# EasyEDA Pro project ProPrj_MBC1  FRAM（AM29F016）(定稿)_2024-09-28.epro, board 1_1
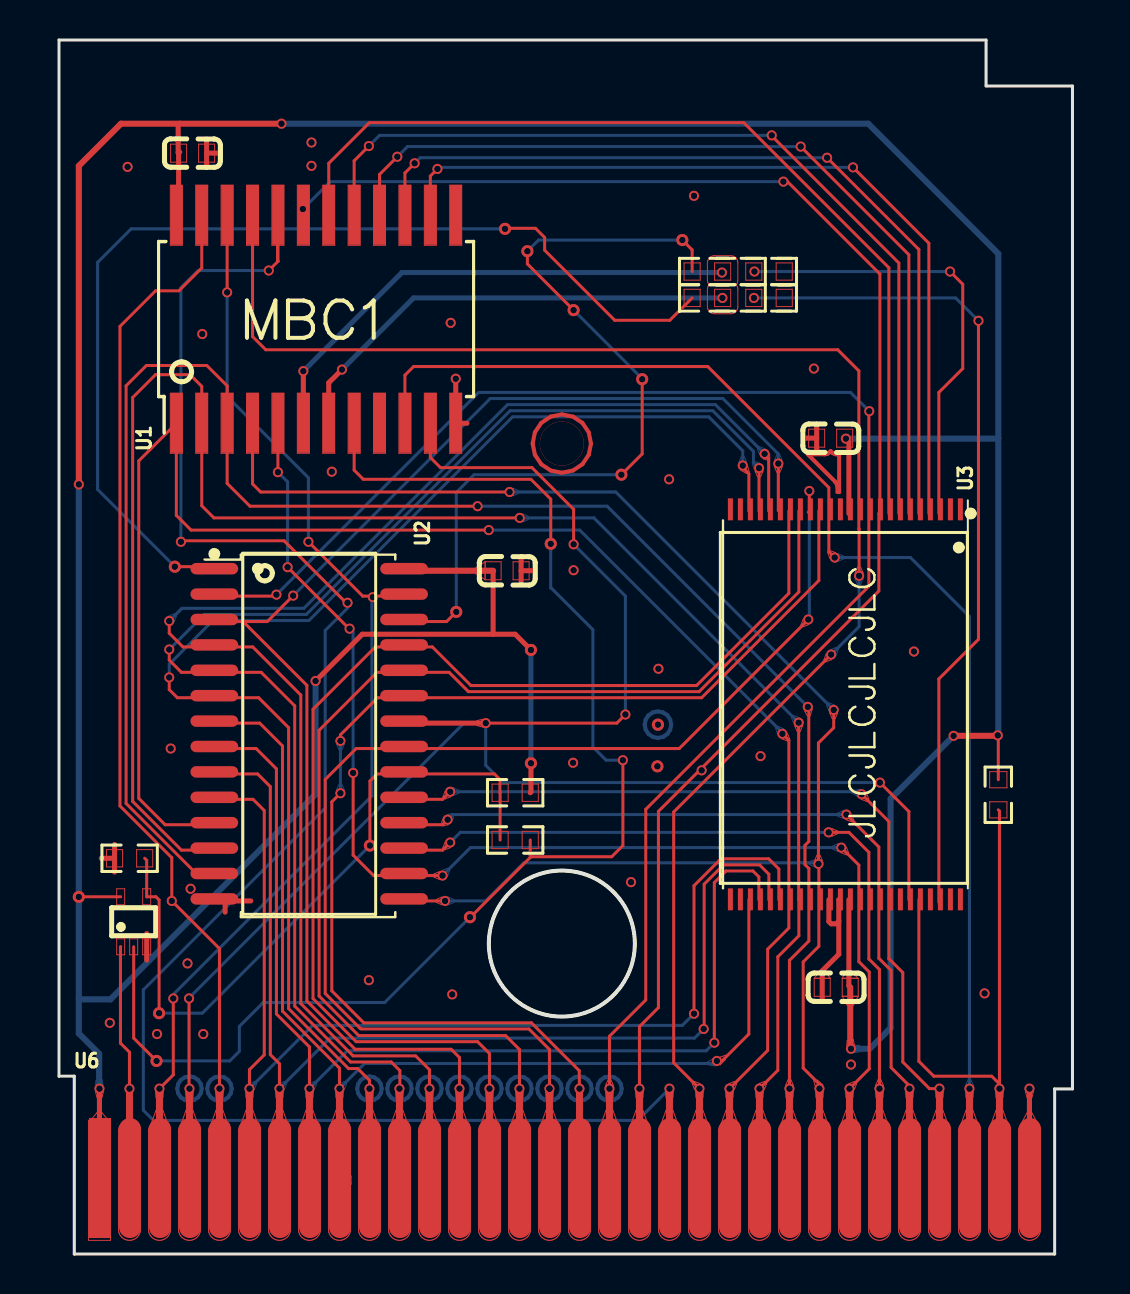
[diagram p5: board, top side]
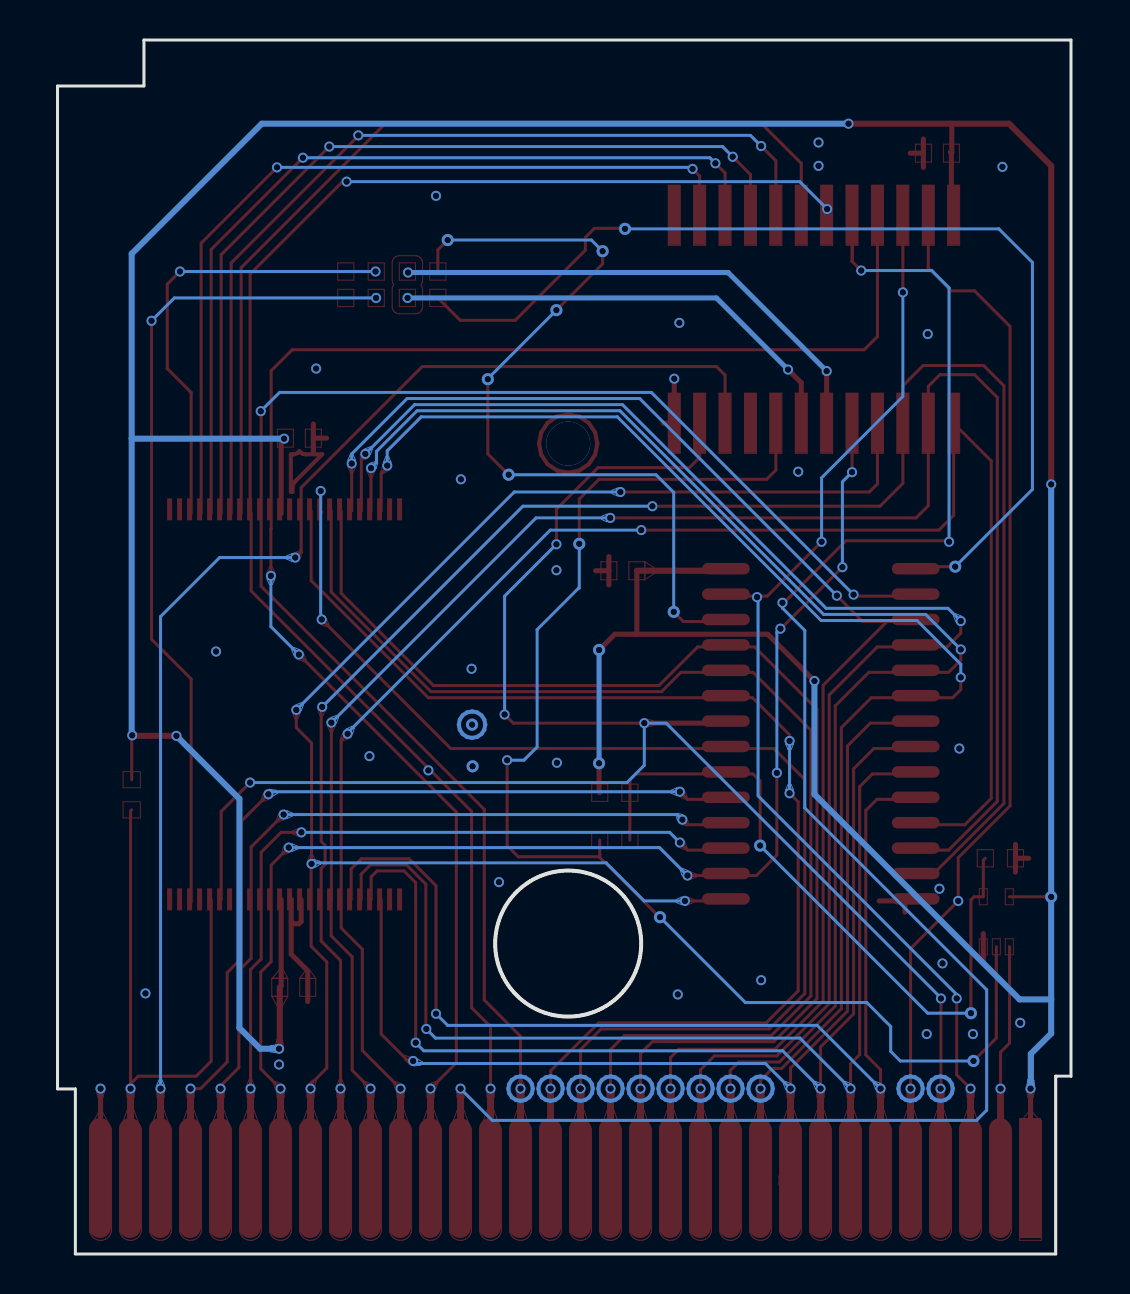
[diagram p6: board, bottom side, seen from below]

Outline 50.67 x 60.7 mm; copper layers: Top Layer, Bottom Layer. Coordinates in mm from the lower left corner of the outline.
Outline path: circle c25.14,15.52 r3.65 ; 0,60.7 46.35,60.7 46.35,58.4 50.67,58.4 50.67,8.25 49.78,8.25 49.78,0 0.76,0 0.76,8.89 0,8.89 0,60.7 ; 21.49,15.52 arc(25.14,19.17) 28.79,15.52 arc(25.14,11.87) 21.49,15.52
Stack: Top Layer 0.035mm / Dielectric1 1.51mm FR4 er 4.5 / Bottom Layer 0.035mm

## Design rules (mm)
spacing safeClearance (default): track to track 0.152, other pairs 0.152 to 0.3
track width trackWidth (default): min 0.127, default 0.254, max 2.54
differential pair differentialPair (default): width min 0.127, default 0.254, max 2.54; gap min 0.152, default 0.152
via viaSize (default): diameter min 0.5, default 0.61, max 10; hole min 0.3, default 0.305, max 6

## Placement (name value [footprint] x y rotation side)
U1  -  [MemoryBC1:SOIC-24 W_7.5x15.4mm_P1.27mm]  12.86 46.76 90 top
U2  FM1808B-SGTR  [SOIC-28_L17.9-W7.5-P1.27-LS10.3-BL]  12.51 26.01 270 top
U3  -  [Package_SO:TSOP-I-48_18.4x12mm_P0.5mm]  39.32 27.48 270 top
U6  -  [gbgba cartbus]  25.3 3.8 0 top

## Footprints (pads in the part's own frame, mm; a bottom-side part is the same pattern mirrored in y, then rotated)
gbgba cartbus
  rect 1.1x6 smd: 1(-23.25,0)
  oval 1.1x6 smd: 2(-21.75,0) 3(-20.25,0) 4(-18.75,0) 5(-17.25,0) 6(-15.75,0) 7(-14.25,0) 8(-12.75,0) 9(-11.25,0) 10(-9.75,0) 11(-8.25,0) 12(-6.75,0) 13(-5.25,0) 14(-3.75,0) 15(-2.25,0) 16(-0.75,0) 17(0.75,0) 18(2.25,0) 19(3.75,0) 20(5.25,0) 21(6.75,0) 22(8.25,0) 23(9.75,0) 24(11.25,0) 25(12.75,0) 26(14.25,0) 27(15.75,0) 28(17.25,0) 29(18.75,0) 30(20.25,0) 31(21.75,0) 32(23.25,0)
MemoryBC1:SOIC-24 W_7.5x15.4mm_P1.27mm
  rect 3x0.6 smd: 1(-5.2,6.985) 2(-5.2,5.715) 3(-5.2,4.445) 4(-5.2,3.175) 5(-5.2,1.905) 6(-5.2,0.635) 7(-5.2,-0.635) 8(-5.2,-1.905) 9(-5.2,-3.175) 10(-5.2,-4.445) 11(-5.2,-5.715) 12(-5.2,-6.985) 13(5.2,-6.985) 14(5.2,-5.715) 15(5.2,-4.445) 16(5.2,-3.175) 17(5.2,-1.905) 18(5.2,-0.635) 19(5.2,0.635) 20(5.2,1.905) 21(5.2,3.175) 22(5.2,4.445) 23(5.2,5.715) 24(5.2,6.985)
Package_SO:TSOP-I-48_18.4x12mm_P0.5mm
  rect 1.1x0.25 smd: 1(-9.75,5.75) 2(-9.75,5.25) 3(-9.75,4.75) 4(-9.75,4.25) 5(-9.75,3.75) 6(-9.75,3.25) 7(-9.75,2.75) 8(-9.75,2.25) 9(-9.75,1.75) 10(-9.75,1.25) 11(-9.75,0.75) 12(-9.75,0.25) 13(-9.75,-0.25) 14(-9.75,-0.75) 15(-9.75,-1.25) 16(-9.75,-1.75) 17(-9.75,-2.25) 18(-9.75,-2.75) 19(-9.75,-3.25) 20(-9.75,-3.75) 21(-9.75,-4.25) 22(-9.75,-4.75) 23(-9.75,-5.25) 24(-9.75,-5.75) 25(9.75,-5.75) 26(9.75,-5.25) 27(9.75,-4.75) 28(9.75,-4.25) 29(9.75,-3.75) 30(9.75,-3.25) 31(9.75,-2.75) 32(9.75,-2.25) 33(9.75,-1.75) 34(9.75,-1.25) 35(9.75,-0.75) 36(9.75,-0.25) 37(9.75,0.25) 38(9.75,0.75) 39(9.75,1.25) 40(9.75,1.75) 41(9.75,2.25) 42(9.75,2.75) 43(9.75,3.25) 44(9.75,3.75) 45(9.75,4.25) 46(9.75,4.75) 47(9.75,5.25) 48(9.75,5.75)
SOIC-28_L17.9-W7.5-P1.27-LS10.3-BL
  oval 0.574x2.388 smd: 1(-8.255,-4.744) 2(-6.985,-4.744) 3(-5.715,-4.744) 4(-4.445,-4.744) 5(-3.175,-4.744) 6(-1.905,-4.744) 7(-0.635,-4.744) 8(0.635,-4.744) 9(1.905,-4.744) 10(3.175,-4.744) 11(4.445,-4.744) 12(5.715,-4.744) 13(6.985,-4.744) 14(8.255,-4.744) 15(8.255,4.744) 16(6.985,4.744) 17(5.715,4.744) 18(4.445,4.744) 19(3.175,4.744) 20(1.905,4.744) 21(0.635,4.744) 22(-0.635,4.744) 23(-1.905,4.744) 24(-3.175,4.744) 25(-4.445,4.744) 26(-5.715,4.744) 27(-6.985,4.744) 28(-8.255,4.744)

## Nets
5V: U1.24 U2.28 U3.12 U3.37 U6.1
GND: U1.12 U2.14 U3.35 U3.36 U6.32
A0: U2.10 U3.30 U6.6
A1: U2.9 U3.29 U6.7
A2: U2.8 U3.28 U6.8
A3: U2.7 U3.27 U6.9
A4: U2.6 U3.22 U6.10
A5: U2.5 U3.21 U6.11
A6: U2.4 U3.20 U6.12
A7: U2.3 U3.19 U6.13
A8: U2.25 U3.18 U6.14
A9: U2.24 U3.17 U6.15
A10: U2.21 U3.16 U6.16
A11: U2.23 U3.15 U6.17
A12: U2.2 U3.10 U6.18
A13: U1.19 U3.9 U6.19
A14: U1.20 U6.20
A15: U6.21
A16: U1.16 U3.6
A17: U1.15 U1.21 U3.5
A18: U1.14 U3.4
AU: U3.44 U6.31
CE: U2.20 U3.11
CLK: U6.2
CS: U1.23 U6.5
D0: U2.11 U3.31 U6.22
D1: U1.2 U2.12 U3.32 U6.23
D2: U1.3 U2.13 U3.33 U6.24
D3: U1.4 U2.15 U3.34 U6.25
D4: U1.5 U2.16 U3.38 U6.26
D5: U2.17 U3.39 U6.27
D6: U2.18 U3.40 U6.28
D7: U2.19 U3.41 U6.29
DO: U1.1
EA0: U1.6 U1.7
O1: U2.1
O2: U2.26
O3: U3.3
O4: U3.46
RA14: U1.18 U3.8
RA15: U1.17 U3.7
RAMCS: U1.8
RD: U1.11 U2.22 U3.43 U6.4
RST: U1.10 U3.14 U6.30
WR: U1.22 U2.27 U6.3

Pads without a net: U1 9 13; U3 1 2 13 23 24 25 26 42 45 47 48

## Via types
v1: diameter 0.305, hole 0.305, Top Layer to Bottom Layer, 161 vias
v2: diameter 0.508, hole 0.305, Top Layer to Bottom Layer, 141 vias
v3: diameter 0.61, hole 0.305, Top Layer to Bottom Layer, 18 vias
v4: diameter 2.2, hole 2.2, Top Layer to Bottom Layer, 1 via

## Routing (per net, layer and track width the routed paths; a pad name or vN(x,y) marks a point on that pad's centre or on a via; arc(x,y) is an arc through that point)
(no net): length 2813.1
  Top Layer w0.152: 31.66,47.8 30.54,46.69 27.79,46.69 24.28,50.19 24.28,50.83 23.82,51.28 22.33,51.28 v3(22.3,51.26) ; v1(5.51,28.83) 5.51,28.22 5.92,27.81 9.98,27.81 11.48,26.32 11.48,12.27 14.48,9.27 14.94,9.27 15.52,8.68 v2(15.52,8.27) ; v1(29.16,43.74) 29.16,40 v3(28.12,38.96) ; 9.68,41.54 9.68,38.51 10.08,38.1 v2(22.53,38.1) ; v1(19.86,32.11) 19.38,31.62 17.6,31.62 ; v1(36.17,26.01) 36.49,25.69 36.49,16.3 35.43,15.24 35.43,10.18 v1(33.52,8.27) ; v2(39.12,20.32) 39.99,19.44 39.99,14.62 40.51,14.1 40.51,9.26 v1(39.52,8.27) ; 37.47,37.08 37.52,37.14 v1(37.52,38.15) ; 34.49,37.15 34.49,39.01 34.19,39.32 v2(34.19,39.42) ; v2(10.87,32.97) 10.79,32.89 8.3,32.89 ; v1(20.93,37.39) 9.55,37.39 8.41,38.53 8.41,43.41 7.39,44.42 4.37,44.42 3.35,43.41 3.35,22.53 6.96,18.92 8.3,18.92 ; v2(38.41,54.81) 42.99,50.22 42.99,37.03 ; v1(5.51,31.65) 5.51,31.04 6.2,30.35 9.69,30.35 12.09,27.95 12.09,12.52 14.71,9.91 17.83,9.91 18.52,9.21 v2(18.52,8.27) ; v1(8.02,8.27) 8.02,15.27 v2(5.64,17.65) 5.64,19.81 3.05,22.4 3.05,46.38 4.83,48.16 5.99,48.16 7.14,49.3 7.14,51.94 ; 22.06,20.7 22.06,23.06 22.05,23.07 22.05,23.72 21.77,24 15.9,24 15.54,23.65 v1(15.54,20.42) ; v1(6.52,8.27) 6.5,8.29 v1(6.5,12.78) ; v1(17.78,54.53) 17.3,54.05 17.3,51.94 ; v1(35.28,40) 35.28,39.95 35.48,39.75 35.48,37.15 ; v2(36.52,8.27) 36.52,14.68 37.49,15.65 37.49,19.28 37.3,19.47 37.3,20.43 37.49,20.62 37.49,27.31 v1(37.44,27.36) ; 8.3,22.73 9.7,22.73 10.26,22.17 10.26,9.96 9.52,9.22 v1(9.52,8.27) ; v1(25.73,47.19) 23.42,49.5 v3(23.42,50.14) ; 41.49,37.03 41.49,49.31 34.24,56.57 15.52,56.57 13.49,54.53 13.49,51.94 ; v2(40.13,22.99) 41.49,21.63 41.49,14.77 42.19,14.07 42.19,9.6 43.52,8.27 v1(44.02,8.27) ; v3(20.55,16.84) 20.57,16.84 23.56,19.83 23.56,19.94 ; v2(20.02,8.27) 20.02,9.82 19.61,10.24 14.81,10.24 12.4,12.65 12.4,28.43 9.2,31.62 ; 18.57,41.54 18.57,39.83 19.07,39.32 23.65,39.32 25.73,37.24 v1(25.73,35.48) ; 43.49,37.03 43.49,50.54 v1(39.7,54.33) ; 31.66,49.12 31.66,50.21 v3(31.17,50.7) ; 43.99,17.58 43.99,28.75 45.97,30.73 v2(45.97,46.66) ; 41.99,37.03 41.99,49.55 35.64,55.91 v2(35.64,55.93) ; 36.49,37.15 36.49,33.04 31.88,28.42 20.6,28.42 18.67,30.35 15.82,30.35 12.7,27.24 12.7,12.77 14.86,10.62 20.93,10.62 21.52,10.02 v1(21.52,8.27) ; v2(11.43,34.34) 14.5,31.27 v1(14.53,31.27) ; v1(19.56,20.57) 19.18,20.19 17.6,20.19 ; 9.2,31.62 10.41,31.62 v2(11.71,32.92) ; 9.2,31.62 8.9,31.62 ; 8.3,21.46 5.31,21.46 3.99,22.78 3.99,39.66 5.87,41.54 5.87,36.93 6.6,36.19 v2(21.49,36.19) ; v1(40.51,42.14) 40.49,42.12 40.49,33.39 29.34,22.23 29.34,12.7 27.52,10.89 v1(27.52,8.27) ; 32.08,24.24 32.13,24.18 v2(32.13,24.18) ; 32.08,24.24 40.99,33.15 41,37.03 ; 32.08,24.24 29.97,22.13 29.97,12.32 29.02,11.37 v1(29.02,8.27) ; 8.3,34.16 8.1,34.37 v3(5.79,34.37) ; v1(12.52,8.27) 12.52,10.35 10.87,12 10.87,24.26 9.85,25.27 8.3,25.27 ; 14.76,51.94 14.76,54.66 v2(15.49,55.4) ; 23.56,19.94 23.56,20.7 ; 23.56,19.94 23.64,19.86 27.63,19.86 28.19,20.42 v1(28.19,24.69) ; 42.49,17.71 42.49,22.12 v2(41.05,23.57) ; v1(28.32,26.97) 27.89,26.54 v2(21.34,26.54) ; 15.75,32.89 17.6,32.89 ; 15.75,32.89 v1(15.7,32.84) ; 15.75,32.89 15.19,32.89 v1(12.47,35.61) ; v1(40,33.91) 40,36.24 39.99,36.25 39.99,44.16 38.94,45.21 10.34,45.21 9.68,45.87 9.68,51.94 ; v2(37.47,31.72) 31.01,25.27 14.86,25.27 13.31,23.72 13.31,13.03 15.06,11.28 15.09,11.28 15.11,11.25 23.5,11.25 24.52,10.22 v1(24.52,8.27) ; v2(14.07,23.04) 13.64,22.61 13.64,13.16 15.24,11.56 23.62,11.56 26.01,9.17 v1(26.02,8.27) ; v1(5.72,12.78) 5.72,8.96 v1(5.02,8.27) ; v2(36.98,26.57) 36.98,17.72 36.99,17.71 36.99,15.91 35.94,14.86 35.94,9.19 v1(35.02,8.27) ; 8.89,31.63 8.9,31.62 ; 8.9,31.62 8.3,31.62 ; 8.3,26.54 10.04,26.54 11.18,25.4 11.18,12.14 14.02,9.29 v2(14.02,8.27) ; v1(38.48,21.08) 39.5,21.08 40.49,20.09 40.49,14.75 41.02,14.22 v1(41.02,8.27) ; v1(31.75,12.01) 31.75,18.42 33.1,19.76 35.48,19.76 35.99,19.25 35.99,17.71 ; v2(32.23,11.25) 32.26,11.28 32.26,18.49 33.22,19.46 35.03,19.46 35.49,18.99 35.49,17.71 ; v2(32.89,9.65) 33.15,9.65 34.49,11 34.49,17.71 ; v1(0.99,17.86) 1,17.86 3.08,17.86 ; v1(32.77,10.57) 32.77,18.57 33.35,19.15 34.7,19.15 34.99,18.86 34.99,17.71 ; v2(3.52,8.27) 3.52,10.09 3.07,10.54 3.07,15.35 3.08,15.36 ; 4.28,19.79 4.38,19.69 4.38,17.86 4.85,17.86 5,17.7 v3(5,12.04) ; 36.99,37.15 36.99,33.11 32,28.12 20.47,28.12 19.51,29.08 15.9,29.08 13,26.19 13,12.9 14.98,10.92 22.33,10.92 23.02,10.23 v1(23.02,8.27) ; v2(5.51,30.23) 5.51,29.69 6.12,29.08 10.11,29.08 11.79,27.41 11.79,12.39 14.58,9.6 16.61,9.6 17.04,9.17 17.04,8.29 v2(17.02,8.27) ; v2(14.43,32.56) 14.35,32.56 11.25,35.66 6.15,35.66 v2(6.1,35.61) ; v1(46.94,25.93) 46.97,25.91 46.97,23.72 ; v2(47.02,8.27) 47.02,8.5 ; 47.02,8.5 47.02,22.15 46.97,22.21 ; 47.02,8.5 46.63,8.89 43.74,8.89 42.99,9.64 42.99,17.71 ; v2(8.41,48.08) 8.41,51.94 ; v2(39.37,21.97) 40.99,20.35 40.99,14.78 41.6,14.17 41.6,9.32 42.52,8.4 v2(42.52,8.27) ; v2(19.56,23.11) 19.18,22.73 17.6,22.73 ; 12.22,51.94 12.22,52.22 v2(12.19,52.25) ; 16.03,51.94 16.03,53.97 v1(16.92,54.86) ; 3.73,15.36 3.73,10.79 v1(4.88,9.65) ; v2(11.02,8.27) 11.02,9.51 10.57,9.97 10.57,23.37 9.93,24 8.3,24 ; 35.99,37.15 35.97,37.18 v2(35.97,39.52) ; 40.99,37.03 41.04,37.08 41.04,49 36.42,53.62 v2(36.22,53.62) ; 17.6,17.65 v1(19.3,17.65) ; v1(35,39.29) 35,37.15 ; v2(18.92,54.25) 18.57,53.9 18.57,51.94 ; v1(38.74,27.2) 38.74,26.31 37.97,25.55 v2(37.97,19.51) 37.99,19.49 37.99,15.39 37.21,14.61 37.21,9.29 38.02,8.48 v2(38.02,8.27) ; 43.99,37.03 43.99,43.08 45.19,44.27 45.19,48.49 v2(44.55,49.12) ; v1(10.95,39.09) 10.95,41.54 ; 10.95,49.64 10.93,49.66 10.93,51.92 10.95,51.94 10.95,49.64 ; 10.95,49.64 10.95,49.63 v1(10.49,49.17) ; v1(32.02,8.27) 30.73,9.56 30.73,22.1 v1(38.61,29.97) ; v1(19.43,21.72) 19.18,21.46 17.6,21.46 ; v1(24.59,35.51) 24.59,37.74 23.6,38.73 15.22,38.73 14.76,39.19 14.76,41.54 ; 17.3,41.54 17.3,43.94 17.73,44.37 32.44,44.37 38.49,38.32 38.49,35.12 v2(38.79,34.82) ; v1(37.08,55.37) 42.49,49.96 42.49,37.03 ; 8.3,20.19 6.12,20.19 3.68,22.63 3.68,42.82 4.83,43.97 6.55,43.97 7.14,43.38 7.14,37.41 7.75,36.81 v1(23.04,36.81) ; 37.99,37.15 37.99,33.67 32.13,27.81 15.93,27.81 14.07,25.96 v1(14.07,25.65) ; v2(19.18,18.92) 15.73,18.92 14.71,19.94 v2(14.71,24.05) ; 26.01,7.98 26.02,7.97
  Top Layer w0.203: 23.68,40.52 23.79,39.96 24.11,39.49 24.58,39.17 25.14,39.06 25.7,39.17 26.17,39.49 26.49,39.96 26.6,40.52 26.49,41.08 26.17,41.55 25.7,41.87 25.14,41.98 24.58,41.87 24.11,41.55 23.79,41.08 23.68,40.52 ; 39.01,38.1 38.99,38.1 38.93,38.1 38.93,38.32 38.89,38.48 38.8,38.62 37.44,39.99 37.48,39.98 38.28,39.98 38.42,40.01 38.54,40.09 38.58,40.15 38.68,40.05 38.81,39.99 38.88,39.98 39.01,39.98 39.01,38.1
  Top Layer w0.254: 13.49,41.54 13.49,43.56 v2(14.15,44.22) ; 12.22,41.54 v1(12.22,44.14) ; 7.38,55.04 7.38,55.75 ; 7.38,55.04 8.04,55.04 ; 7.38,55.04 7.38,54.33 ; 5.98,55.04 6.03,55.1 ; 5.98,55.04 5.98,52.05 5.87,51.94 ; 5.98,55.04 5.96,55.06 5.96,56.44 6.03,56.52 ; v2(33.15,49.07) 33.18,49.11 33.18,49.12 ; 39.49,17.71 39.49,13.4 39.56,13.33 ; 39.49,37.03 39.49,40.58 39.31,40.77 ; 21.71,30.99 22.81,30.99 v1(23.6,30.2) ; 21.71,30.99 21.71,34.16 ; 21.71,30.99 15.16,30.99 v1(12.83,28.65) ; v1(2.02,8.27) 2.02,3.68 ; v3(23.6,24.54) 23.6,23.1 23.56,23.06 ; 38.99,16.64 38.99,14.99 38.16,14.16 38.16,12.63 ; 38.99,16.64 38.99,17.71 38.99,17.71 ; 38.99,16.64 38.86,16.51 38.61,16.51 38.49,16.62 38.49,17.71 ; 4.38,16.02 4.38,14.7 ; 8.3,17.65 7.02,17.65 ; 8.3,17.65 9.59,17.65 ; 8.3,17.65 8.3,17.09 ; 2.78,19.79 2.78,19.1 ; 2.78,19.79 2.78,20.48 ; 2.78,19.79 2.11,19.79 ; 23.11,34.16 23.11,33.45 ; 23.11,34.16 23.76,34.16 ; 23.11,34.16 23.11,34.87 ; 37.88,40.79 37.88,41.5 ; 37.88,40.79 37.88,40.08 ; 37.88,40.79 37.22,40.79 ; v2(21.34,26.54) 17.6,26.54 ; v1(33.17,47.8) 33.18,47.8 ; 20.4,41.54 19.84,41.54 v1(19.84,43.76) ; 48.52,3.68 v1(48.52,8.27)
  Top Layer w0.305: 39.28,40.79 39.31,40.77 v2(39.34,40.77) ; v1(0.99,38.48) 0.99,54.41 3.1,56.52 v1(11.12,56.52) ; v1(44.73,25.91) 46.91,25.91 v1(46.94,25.93) ; 39.56,13.33 39.56,10.3 v1(39.6,10.26) ; 17.6,34.16 21.71,34.16
  Top Layer w0.35: v1(12.52,8.27) 12.52,3.68 ; v1(21.52,8.27) 21.52,3.68 ; v1(9.52,8.27) 9.52,3.68 ; v1(23.02,8.27) 23.02,3.68 ; v1(24.52,8.27) 24.52,3.68 ; v1(5.02,8.27) 5.02,3.68 ; v1(35.02,8.27) 35.02,3.68 ; v1(33.52,8.27) 33.52,3.68 ; v1(26.02,8.27) 26.02,3.68 ; v2(17.02,8.27) 17.02,3.68 ; v1(27.52,8.27) 27.52,3.68 ; v1(39.52,8.27) 39.52,3.68 ; v1(29.02,8.27) 29.02,3.68 ; v2(11.02,8.27) 11.02,3.68 ; v2(15.52,8.27) 15.52,3.68 ; v1(8.02,8.27) 8.02,3.68 ; v2(30.52,8.27) 30.52,3.68 ; v1(6.52,8.27) 6.52,3.68 ; v1(41.02,8.27) 41.02,3.68 ; v2(47.02,8.27) 47.02,3.68 ; v2(36.52,8.27) 36.52,3.68 ; v1(44.02,8.27) 44.02,3.68 ; v1(45.52,8.27) 45.52,3.68 ; v2(18.52,8.27) 18.52,3.68 ; v2(3.52,8.27) 3.52,3.68 ; v2(42.52,8.27) 42.52,3.68 ; v2(20.02,8.27) 20.02,3.68 ; v1(32.02,8.27) 32.02,3.68 ; v2(38.02,8.27) 38.02,3.68
  Top Layer w0.351: 14.2,3.27 14.45,3.52 14.45,3.86 14.02,4.29 v2(14.02,8.27)
  Bottom Layer w0.152: v1(16.92,54.86) 17.42,55.37 v1(37.08,55.37) ; v1(12.47,35.61) 12.47,38.81 8.41,42.88 v2(8.41,48.08) ; v2(22.53,38.1) 27.84,38.1 v1(38.74,27.2) ; v1(6.5,12.78) 6.5,12.8 20.24,26.54 v2(21.34,26.54) 21.34,24.44 22.2,23.57 v2(41.05,23.57) ; v2(11.71,32.92) 21.56,42.77 33.19,42.77 35.97,40 v2(35.97,39.52) ; v2(36.98,26.57) 26.75,36.81 v1(23.04,36.81) ; v2(21.49,36.19) 26.03,36.19 36.17,26.06 v1(36.17,26.01) ; v2(5.51,30.23) 7.26,31.98 12.37,31.98 22.55,42.16 32.69,42.16 34.72,40.13 34.72,39.57 v1(35,39.29) ; v2(34.19,39.42) 34.19,40.16 32.49,41.86 22.68,41.86 12.5,31.67 7.7,31.67 5.51,29.49 v1(5.51,28.83) ; v1(24.59,35.51) 24.59,33.3 24.61,33.3 26.69,31.22 26.69,25.35 27.36,24.69 v1(28.19,24.69) ; v2(14.02,8.27) 15.28,9.53 32.77,9.53 v2(32.89,9.65) ; v2(35.64,55.93) 16.03,55.93 v2(15.49,55.4) ; v2(39.12,20.32) 20.57,20.32 v2(19.18,18.92) ; v1(15.54,20.42) 7.16,12.04 v3(5,12.04) ; v2(14.43,32.56) 14.43,32.3 13.31,31.18 13.31,22.3 4.22,13.21 4.22,7.19 4.72,6.68 28.94,6.68 v2(30.52,8.27) ; v1(40,33.91) 40,31.37 v1(38.61,29.97) ; v2(18.92,54.25) 19,54.33 v1(39.7,54.33) ; v1(15.7,32.84) 15.65,32.79 15.65,22.91 5.72,12.98 v1(5.72,12.78) ; v1(4.88,9.65) 8.53,9.65 9.02,10.13 9.02,11.38 10.21,12.57 16.28,12.57 v3(20.55,16.84) ; v1(37.52,38.15) 37.52,31.78 v2(37.47,31.72) ; v3(23.42,50.14) 23.98,50.7 v3(31.17,50.7) ; v2(38.79,34.82) 42.57,34.82 45.52,31.87 v1(45.52,8.27) ; v2(14.71,24.05) 14.71,31.09 v1(14.53,31.27) ; v1(19.86,32.11) 19.86,38.08 20.75,38.96 v3(28.12,38.96) ; v2(40.13,22.99) 40,23.11 v2(19.56,23.11) ; v2(37.97,19.51) 37.92,19.56 23.24,19.56 21.34,17.65 v1(19.3,17.65) ; v3(22.3,51.26) 3.61,51.26 1.93,49.58 1.93,38.23 v3(5.79,34.37) ; v2(10.87,32.97) 20.98,43.08 39.57,43.08 v1(40.51,42.14) ; v2(38.41,54.81) 18.06,54.81 v1(17.78,54.53) ; v1(5.51,31.65) 6.15,32.28 12.24,32.28 22.43,42.47 32.82,42.47 v1(35.28,40) ; v1(37.44,27.36) 27.41,37.39 v1(20.93,37.39) ; v2(6.1,35.61) 6.1,48.31 6.96,49.17 v1(10.49,49.17) ; v1(25.73,47.19) 29.16,43.76 v1(29.16,43.74) ; v1(19.43,21.72) 19.69,21.97 v2(39.37,21.97) ; v2(32.23,11.25) 31.78,10.79 13.55,10.79 v2(11.02,8.27) ; v2(34.75,47.8) 44.83,47.8 v2(45.97,46.66) ; v1(25.73,35.48) 28.32,32.89 v1(28.32,26.97) ; v2(11.43,34.34) 11.43,38.61 v1(10.95,39.09) ; v1(9.52,8.27) 12.69,11.43 31.17,11.43 v1(31.75,12.01) ; v2(12.19,52.25) 13.56,53.62 v2(36.22,53.62) ; v1(14.07,25.65) v2(14.07,23.04) ; v1(19.56,20.57) 20.07,21.08 v1(38.48,21.08) ; v2(34.77,49.12) v2(44.55,49.12) ; v1(32.77,10.57) 32.36,10.16 14.41,10.16 v1(12.52,8.27)
  Bottom Layer w0.203: 30.42,26.94 30.2,27.08 29.95,27.13 29.69,27.08 29.48,26.94 29.33,26.72 29.28,26.47 29.33,26.21 29.48,26 29.69,25.85 29.95,25.8 30.2,25.85 30.42,26 30.56,26.21 30.61,26.47 30.56,26.72 30.42,26.94 ; 6.09,7.84 6.29,7.7 6.52,7.66 6.76,7.7 6.96,7.84 7.09,8.03 7.14,8.27 7.09,8.5 6.96,8.7 6.76,8.83 6.52,8.88 6.29,8.83 6.09,8.7 5.96,8.5 5.91,8.27 5.96,8.03 6.09,7.84 ; 19.79,8.83 19.59,8.7 19.46,8.5 19.41,8.27 19.46,8.03 19.59,7.84 19.79,7.7 20.02,7.66 20.26,7.7 20.46,7.84 20.59,8.03 20.63,8.27 20.59,8.5 20.46,8.7 20.26,8.83 20.02,8.88 19.79,8.83 ; 25.79,8.83 25.59,8.7 25.46,8.5 25.41,8.27 25.46,8.03 25.59,7.84 25.79,7.7 26.02,7.66 26.26,7.7 26.46,7.84 26.59,8.03 26.63,8.27 26.59,8.5 26.46,8.7 26.26,8.83 26.02,8.88 25.79,8.83 ; 19.13,8.27 19.09,8.5 18.96,8.7 18.76,8.83 18.52,8.88 18.29,8.83 18.09,8.7 17.96,8.5 17.91,8.27 17.96,8.03 18.09,7.84 18.29,7.7 18.52,7.66 18.76,7.7 18.96,7.84 19.09,8.03 19.13,8.27 ; 24.09,8.7 23.96,8.5 23.91,8.27 23.96,8.03 24.09,7.84 24.29,7.7 24.52,7.66 24.76,7.7 24.96,7.84 25.09,8.03 25.13,8.27 25.09,8.5 24.96,8.7 24.76,8.83 24.52,8.88 24.29,8.83 24.09,8.7 ; 8.63,8.27 8.59,8.5 8.46,8.7 8.26,8.83 8.02,8.88 7.79,8.83 7.59,8.7 7.46,8.5 7.41,8.27 7.46,8.03 7.59,7.84 7.79,7.7 8.02,7.66 8.26,7.7 8.46,7.84 8.59,8.03 8.63,8.27 ; 21.96,7.84 22.09,8.03 22.13,8.27 22.09,8.5 21.96,8.7 21.76,8.83 21.52,8.88 21.29,8.83 21.09,8.7 20.96,8.5 20.91,8.27 20.96,8.03 21.09,7.84 21.29,7.7 21.52,7.66 21.76,7.7 21.96,7.84 ; 22.41,8.27 22.46,8.03 22.59,7.84 22.79,7.7 23.02,7.66 23.26,7.7 23.46,7.84 23.59,8.03 23.63,8.27 23.59,8.5 23.46,8.7 23.26,8.83 23.02,8.88 22.79,8.83 22.59,8.7 22.46,8.5 22.41,8.27 ; 16.79,7.7 17.02,7.66 17.26,7.7 17.46,7.84 17.59,8.03 17.63,8.27 17.59,8.5 17.46,8.7 17.26,8.83 17.02,8.88 16.79,8.83 16.59,8.7 16.46,8.5 16.41,8.27 16.46,8.03 16.59,7.84 16.79,7.7 ; 14.96,8.03 15.09,7.84 15.29,7.7 15.52,7.66 15.76,7.7 15.96,7.84 16.09,8.03 16.13,8.27 16.09,8.5 15.96,8.7 15.76,8.83 15.52,8.88 15.29,8.83 15.09,8.7 14.96,8.5 14.91,8.27 14.96,8.03 ; 26.91,8.27 26.96,8.03 27.09,7.84 27.29,7.7 27.52,7.66 27.76,7.7 27.96,7.84 28.09,8.03 28.13,8.27 28.09,8.5 27.96,8.7 27.76,8.83 27.52,8.88 27.29,8.83 27.09,8.7 26.96,8.5 26.91,8.27
  Bottom Layer w0.254: v1(23.6,30.2) v3(23.6,24.54) ; v2(14.15,44.22) 17.73,47.8 v1(33.17,47.8) ; v1(12.22,44.14) 17.15,49.07 v2(33.15,49.07)
  Bottom Layer w0.305: 46.97,40.79 46.97,25.96 v1(46.94,25.93) ; 46.97,40.79 46.97,50.01 40.46,56.52 v1(11.12,56.52) ; 46.97,40.79 46.95,40.77 v2(39.34,40.77) ; v1(44.73,25.91) 41.58,22.76 41.58,11.3 40.54,10.26 v1(39.6,10.26) ; 0.99,12.73 v1(0.99,17.86) v1(0.99,38.48) ; 0.99,12.73 0.99,11.02 2.01,10.01 2.01,8.28 v1(2.02,8.27) ; 0.99,12.73 2.57,12.73 12.83,22.99 v1(12.83,28.65)
  vias: v1(2.54,11.56) v1(3.43,54.36) v1(4.9,11) v1(5.58,25.27) v1(6.43,14.53) v1(6.58,18.26) v1(7.16,46) v1(7.21,11) v1(12.62,55.58) v1(12.62,54.41) v1(13.64,39.12) v1(15.49,13.69) v1(19.58,46.56) v1(19.66,12.98) v1(25.73,34.19) v1(25.71,24.56) v1(28.6,18.59) v1(29.95,26.47) v1(29.92,24.38) v1(29.97,29.26) v1(30.5,38.73) v1(31.75,52.91) v1(35.08,24.89) v1(37.74,44.27) v1(39.6,9.47) v1(42.75,30.12) v1(46.28,13.03) v2(2.54,11.56) v2(3.43,54.36) v2(4.9,11) v2(5.58,25.27) v2(6.43,14.53) v2(6.58,18.26) v2(7.16,46) v2(7.21,11) v2(12.62,55.58) v2(12.62,54.41) v2(13.64,39.12) v2(15.49,13.69) v2(19.58,46.56) v2(19.66,12.98) v2(25.73,34.19) v2(25.71,24.56) v2(28.6,18.59) v2(29.97,29.26) v2(30.5,38.73) v2(31.75,52.91) v2(35.08,24.89) v2(37.74,44.27) v2(39.6,9.47) v2(42.75,30.12) v2(46.28,13.03) v3(29.95,26.47) v3(29.92,24.38) v4(25.14,40.52)
